# Altium schematic sheet 04. SENSOR SHT30, PIR, TSL2561.SchDoc
size A3
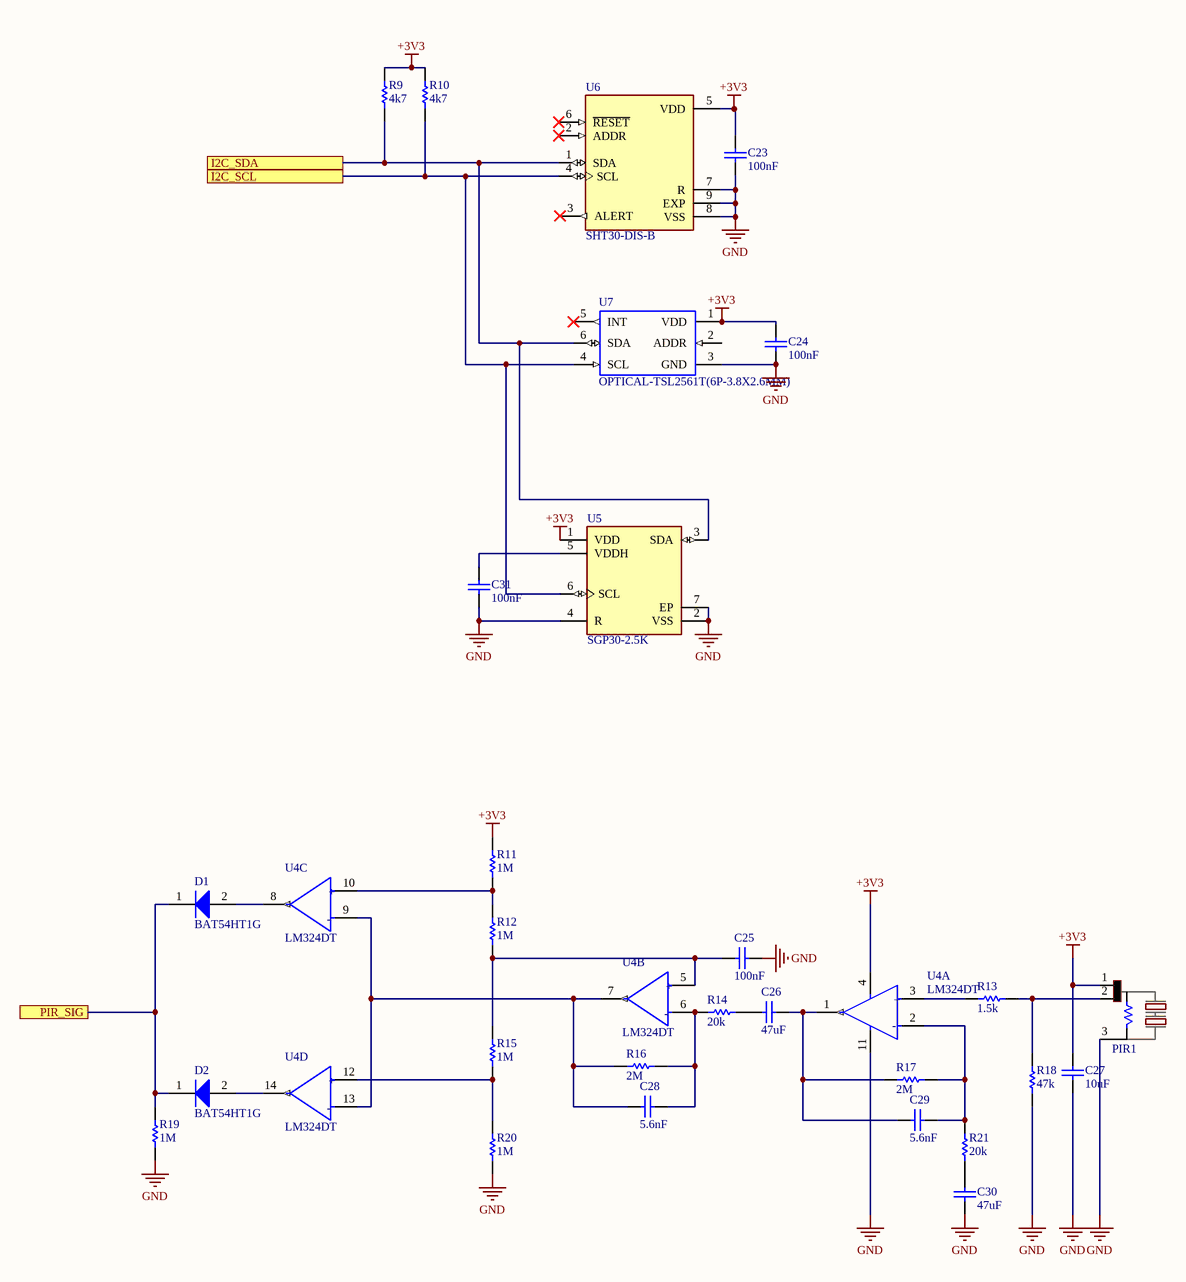
[diagram p0: 04. SENSOR SHT30, PIR, TSL2561.SchDoc]

## Parts
C23  100nF  [CAPC1005X56X25NL10T15]
C24  100nF  [CAPC1005X56X25NL10T15]
C25  100nF  [CAPC1005X56X25NL10T15]
C26  47uF  [CAPC1608X90X35NL10T15]
C27  10uF  [CAPC1608X90X35NL10T15]
C28  5.6nF  [CAPC1005X56X25NL10T15]
C29  5.6nF  [CAPC1005X56X25NL10T15]
C30  47uF  [CAPC1608X90X35NL10T15]
C31  100nF  [CAPC1005X56X25NL10T15]
D1  BAT54HT1G  [ONSC-SOD-323-2-477-02_V]
D2  BAT54HT1G  [ONSC-SOD-323-2-477-02_V]
PIR1  D203S  [D203B PIR]  (value not drawn)
R9  4k7  [RESC1005X40X25NL05T05]
R10  4k7  [RESC1005X40X25NL05T05]
R11  1M  [RESC1005X40X25NL05T05]
R12  1M  [RESC1005X40X25NL05T05]
R13  1.5k  [RESC1005X40X25NL05T05]
R14  20k  [RESC1005X40X25NL05T05]
R15  1M  [RESC1005X40X25NL05T05]
R16  2M  [RESC1005X40X25NL05T05]
R17  2M  [RESC1005X40X25NL05T05]
R18  47k  [RESC1005X40X25NL05T05]
R19  1M  [RESC1005X40X25NL05T05]
R20  1M  [RESC1005X40X25NL05T05]
R21  20k  [RESC1005X40X25NL05T05]
U4  LM324DT  [FP-SO-14-MFG]  (parts A,B,C,D of 4)
U5  SGP30-2.5K  [FP-SGP30-2_5K-MFG]
U6  SHT30-DIS-B  [DFN250X250X100-9N]
U7  OPTICAL-TSL2561T(6P-3.8X2.6MM)  [TMB6-1.55-3.8X2.6MM]

## Ports
I2C_SCL, I2C_SDA, PIR_SIG

## Nets
+3V3: C23.2 C24.2 C27.1 PIR1.1(VDD) R9.2 R10.2 R11.2 U4.4(VCC+) U5.1(VDD) U6.5(VDD) U7.1(VDD)
GND: C23.1 C24.1 C25.2 C27.2 C30.1 C31.1 PIR1.3(VDD) R18.2 R19.1 R20.1 U4.11(VCC-) U5.2(VSS) U5.4(R) U5.7(EP) U6.7(R) U6.8(VSS) U6.9(EXP) U7.3(GND)
I2C_SCL: R10.1 U5.6(SCL) U6.4(SCL) U7.4(SCL) ; port I2C_SCL
I2C_SDA: R9.1 U5.3(SDA) U6.1(SDA) U7.6(SDA) ; port I2C_SDA
PIR_SIG: D1.1(K) D2.1(K) R19.2 ; port PIR_SIG
NetC25_1: C25.1 R12.1 R15.2 U4.5(Non-Inverting_Input_2)
NetC26_1: C26.1 R14.1
NetC26_2: C26.2 C29.1 R17.2 U4.1(Output_1)
NetC28_1: C28.1 R16.2 U4.7(Output_2) U4.9(Inverting_Input_3) U4.13(Inverting_Input_4)
NetC28_2: C28.2 R14.2 R16.1 U4.6(Inverting_Input_2)
NetC29_2: C29.2 R17.1 R21.1 U4.2(Inverting_Input_1)
NetC30_2: C30.2 R21.2
NetC31_2: C31.2 U5.5(VDDH)
NetD1_2: D1.2(A) U4.8(Output_3)
NetD2_2: D2.2(A) U4.14(Output_4)
NetPIR1_2: PIR1.2(G) R13.2 R18.1
NetR11_1: R11.1 R12.2 U4.10(Non-Inverting_Input_3)
NetR13_1: R13.1 U4.3(Non-Inverting_Input_1)
NetR15_1: R15.1 R20.2 U4.12(Non-Inverting_Input_4)

Not connected (* = marked no-connect by the designer): U6 2(ADDR)* 3(ALERT)* 6(~{RESET})*; U7 2(ADDR) 5(INT)*

## Notes on the sheet
- Title
- Size:
- Date:
- A4
- Number:
- Time:
- Revision:
- Sheet
- of
- N.S.T
- Design by:
- Check by:
- https://github.com/tung080827
- (in symbol CMP-12131-000005-1, part A) +; -
- (in symbol CMP-12131-000005-1, part B) +; -
- (in symbol CMP-12131-000005-1, part C) +; -
- (in symbol CMP-12131-000005-1, part D) +; -

## Library data of the parts
C23-C25 C28 C29 C31 = CMP-2008-02743-1: Manufacturer: AVX Interconnect / Elco; Part Number: 04026D104KAT2A
C26 C27 C30 = CMP-2006-02792-1: Part Number: GRM188R60J106ME47D; Manufacturer: Murata
D1 D2 = CMP-1055-00462-1: Schottky Barrier Diode, 2-Pin SOD-323, Pb-Free, Tape and Reel; Manufacturer: On Semiconductor; Configuration: Single; trr Max (ns): 5; IFSM Max (A): 0.6; ComponentLink3URL: http://www.onsemi.com/pub_link/Collateral/477-02.PDF.1; PackageDescription: 2-Pin SOD, Body 1.7 x 1.25 mm; ComponentLink2URL: http://www.onsemi.cn/pub_link/Collateral/BAT54HT1-D.PDF; ComponentLink3Description: Package Specification; ComponentLink2Description: Datasheet; DatasheetVersion: Rev. 6; PackageReference: SOD-323-2-477-02; RoHS: TRUE; ComponentLink1URL: http://www.onsemi.com/; Packing: Tape and Reel; PartNumber: BAT54HT1G; Mounting Technology: Surface Mount; ComponentLink1Description: Manufacturer URL; PackageVersion: Rev. H, 03/2007
R9-R21 = CMP-2000-07588-1: Chip Resistor, 10 KOhm, +/- 1%, 0.1 W, -55 to 155 degC, 0402 (1005 Metric), RoHS, Tape and Reel; Manufacturer: Panasonic; Power Rating: 100mW; Voltage Rating: 50V; Resistance: 10KOhm; Case\/Package: 0402; Temperature Coefficient: 100ppm\/degreesC; RoHSCompliant: True; Lead Free: LeadFree; Package Quantity: 1; Contact Plating: Tin; Length: 1mm; Radiation Hardening: No; REACH SVHC: NoSVHC; Max Operating Temperature: 155degC; Depth: 0.5mm; Case Code (Imperial): 0402; Military Standard: Not; Package Description: 2-Pin Surface Mount Device, Body 1 x 0.5 mm; Termination: SMD/SMT; Case Code (Metric): 1005; Height: 0.35mm; Packaging: TapeandReel; Voltage Rating (DC): 50V; Package Reference: 402; Number of Pins: 2; Tolerance: 1%; Mounting Technology: SurfaceMount; Width: 0.02inch; Mount: SurfaceMount; Datasheet URL: https://industrial.panasonic.com/cdbs/www-data/pdf/RDA0000/AOA0000C304.pdf; Composition: ThickFilm; Datasheet Version: 02/2017; Manufacturer URL: http://www.panasonic.com/; Max Power Dissipation: 100mW; Number of Terminations: 2; Min Operating Temperature: -55degC
U4 = CMP-12131-000005-1: IC OPAMP GP 4 CIRCUIT 14SO; Manufacturer: STMicroelectronics; Voltage Gain: 100dB; Standoff Height: 0.1mm; Bandwidth: 1.3MHz; Max Junction Temp: +150°C; Min Supply Voltage: 3V; Max Dual Supply Voltage: 15V; Min Dual Supply Voltage: 1.5V; Number Of Channels: 4; Nominal Supply Current: 0.7-1.5mA; Output Current Per Channel: 20-50mA; Max Supply Voltage: 30V; Input Offset Voltage: 2mV; Input Bias Current: 0.02uA; Device Class L1: Integrated Circuits (ICs); Device Class L3: Amplifiers - Op Amps; Temperature Range Low: 0°C; Package: SO-14; Temperature Range High: +70°C; Digikey Description: IC OPAMP GP 4 CIRCUIT 14SO; Device Class L2: Linear ICs; Footprint Url: https://www.st.com/content/ccc/resource/technical/document/datasheet/group3/10/8a/e6/12/f8/e8/49/ce/DM00366438/files/DM00366438.pdf/jcr:content/translations/en.DM00366438.pdf; Octopart: https://octopart.com/lm324dt-stmicroelectronics-39579146; ComponentLink2URL: https://www.st.com/content/ccc/resource/technical/document/datasheet/bd/fc/46/43/26/8f/40/7f/CD00001046.pdf/files/CD00001046.pdf/jcr:content/translations/en.CD00001046.pdf; ComponentLink2Description: Datasheet; Lead Free: Yes; Temperature: 0°C to +70°C; RoHS: TRUE; Gain Bandwidth: 1.3MHz; Manufacturer Part Number: LM324DT; Automotive: No; Category: IC; Height: 1.75mm; Mouser Description: LM324 Series 32 V 1.3 MHz Low Power Quad Operational Amplifier - SOIC-14
U5 = CMP-144026-000002-1: AIR QUALITY GAS SENSOR FOR VOC'S; Manufacturer: Sensirion; Min Supply Voltage: 1.62V; Sensor Output: I2C; Operating Supply Current: 48.8mA; Max Supply Voltage: 1.98V; Category: IC; Automotive: No; Device Class L3: unset; Device Class L1: Sensors; Device Class L2: unset; Temperature Range High: +85°C; Manufacturer Part Number: SGP30-2.5K; Octopart: https://octopart.com/sgp30-2.5k-sensirion-84561789; Height: 0.9mm; Temperature: -40°C to +85°C; Lead Free: Yes; Package: SGP30-2.5K; Temperature Range Low: -40°C; Digikey Description: AIR QUALITY GAS SENSOR FOR VOC'S; RoHS: TRUE; ComponentLink2Description: Datasheet; ComponentLink2URL: https://www.sensirion.com/fileadmin/user_upload/customers/sensirion/Dokumente/0_Datasheets/Gas/Sensirion_Gas_Sensors_SGP30_Datasheet.pdf
U6 = SHT30-DIS-B: Humidity Temperature Sensor 0 ~ 100% RH IÂ²C Â±3% RH 8s Surface Mount; MF: Sensirion AG; Package: DFN-8 Sensirion; Availability: Unavailable; MP: SHT30-DIS-B; Value: *; SnapEDA_Link: https://www.snapeda.com/parts/SHT30-DIS-B/Sensirion%20AG/view-part/231868/?ref=snap; Price: None
U7 = OPTICAL-TSL2561T(6P-3.8X2.6MM): Optical Sensor Ambient 640nm IÂ²C 6-SMD, No Lead; MF: ams; Price: None; Value: *; MP: TSL2561T; Package: SMD-6 ams; SnapEDA_Link: https://www.snapeda.com/parts/TSL2561T/ams/view-part/225280/?ref=snap; Availability: Unavailable